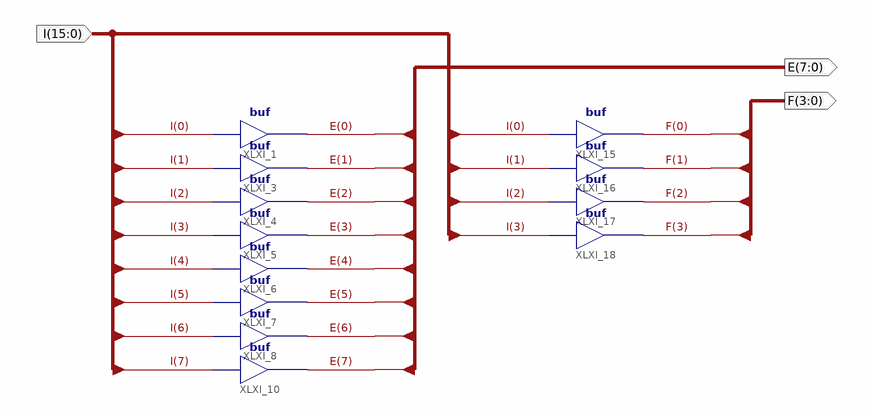
[diagram p0: schematic sheet 1]
// Xilinx ISE schematic truncate16x8x4.sch (spartan6) as structural Verilog: 12 symbols, 3 ports
module truncate16x8x4 (
  input  [15:0] I,
  output [7:0] E,
  output [3:0] F
);

  buf XLXI_1 (E[0], I[0]);
  buf XLXI_3 (E[1], I[1]);
  buf XLXI_4 (E[2], I[2]);
  buf XLXI_5 (E[3], I[3]);
  buf XLXI_6 (E[4], I[4]);
  buf XLXI_7 (E[5], I[5]);
  buf XLXI_8 (E[6], I[6]);
  buf XLXI_10 (E[7], I[7]);
  buf XLXI_15 (F[0], I[0]);
  buf XLXI_16 (F[1], I[1]);
  buf XLXI_17 (F[2], I[2]);
  buf XLXI_18 (F[3], I[3]);
endmodule
